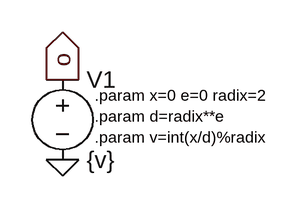
[diagram p0: schematic bit-extract.asc]
bit-extract.asc, the LTspice schematic file:
Version 4
SHEET 1 880 680
FLAG 112 208 0
FLAG 112 128 o
IOPIN 112 128 Out
SYMBOL voltage 112 112 R0
SYMATTR InstName V1
SYMATTR Value {v}
TEXT 144 144 Left 1 !.param x=0 e=0 radix=2\n.param d=radix**e\n.param v=int(x/d)%radix

The netlist it stands for:
* bit-extract.asc
V1 o 0 {v}
.param x=0 e=0 radix=2
.param d=radix**e
.param v=int(x/d)%radix
.backanno
.end